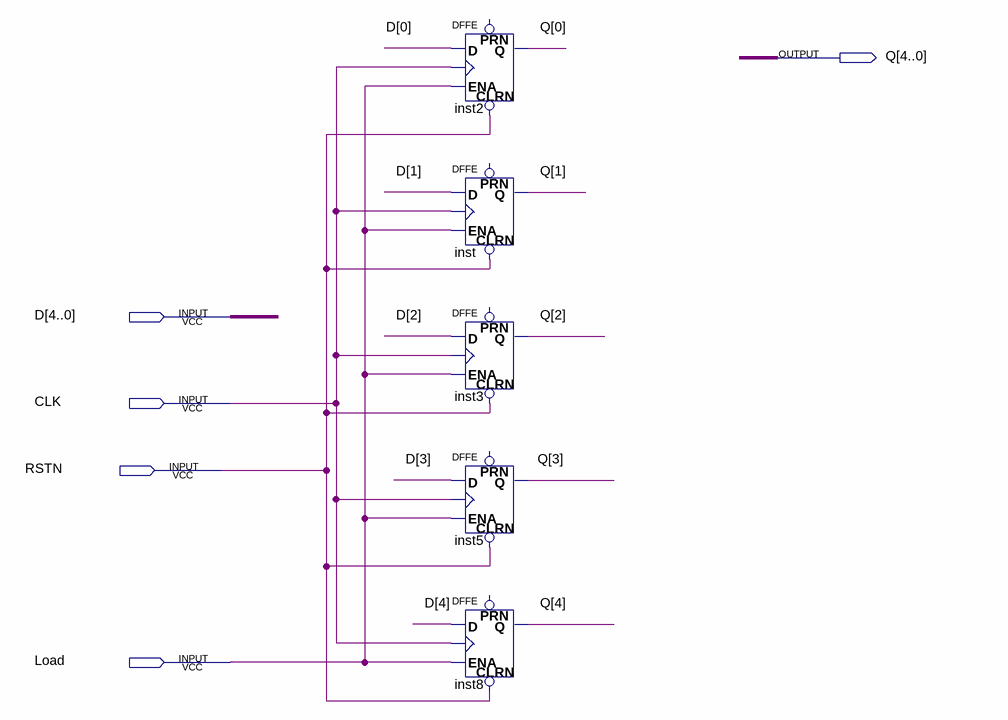
[diagram p0: schematic sheet]
// Quartus schematic res5.bdf as structural Verilog: 5 symbols, 5 pins
module res5 (
  input  [4:0] D,
  input  CLK,
  input  RSTN,
  input  Load,
  output [4:0] Q
);

  DFFE inst2 (.CLRN(RSTN), .D(D[0]), .CLK(CLK), .ENA(Load), .Q(Q[0]));  // open: PRN
  DFFE inst (.CLRN(RSTN), .D(D[1]), .CLK(CLK), .ENA(Load), .Q(Q[1]));  // open: PRN
  DFFE inst3 (.CLRN(RSTN), .D(D[2]), .CLK(CLK), .ENA(Load), .Q(Q[2]));  // open: PRN
  DFFE inst5 (.CLRN(RSTN), .D(D[3]), .CLK(CLK), .ENA(Load), .Q(Q[3]));  // open: PRN
  DFFE inst8 (.CLRN(RSTN), .D(D[4]), .CLK(CLK), .ENA(Load), .Q(Q[4]));  // open: PRN
endmodule
